# Altium schematic sheet GIC_G1.SchDoc
size A4
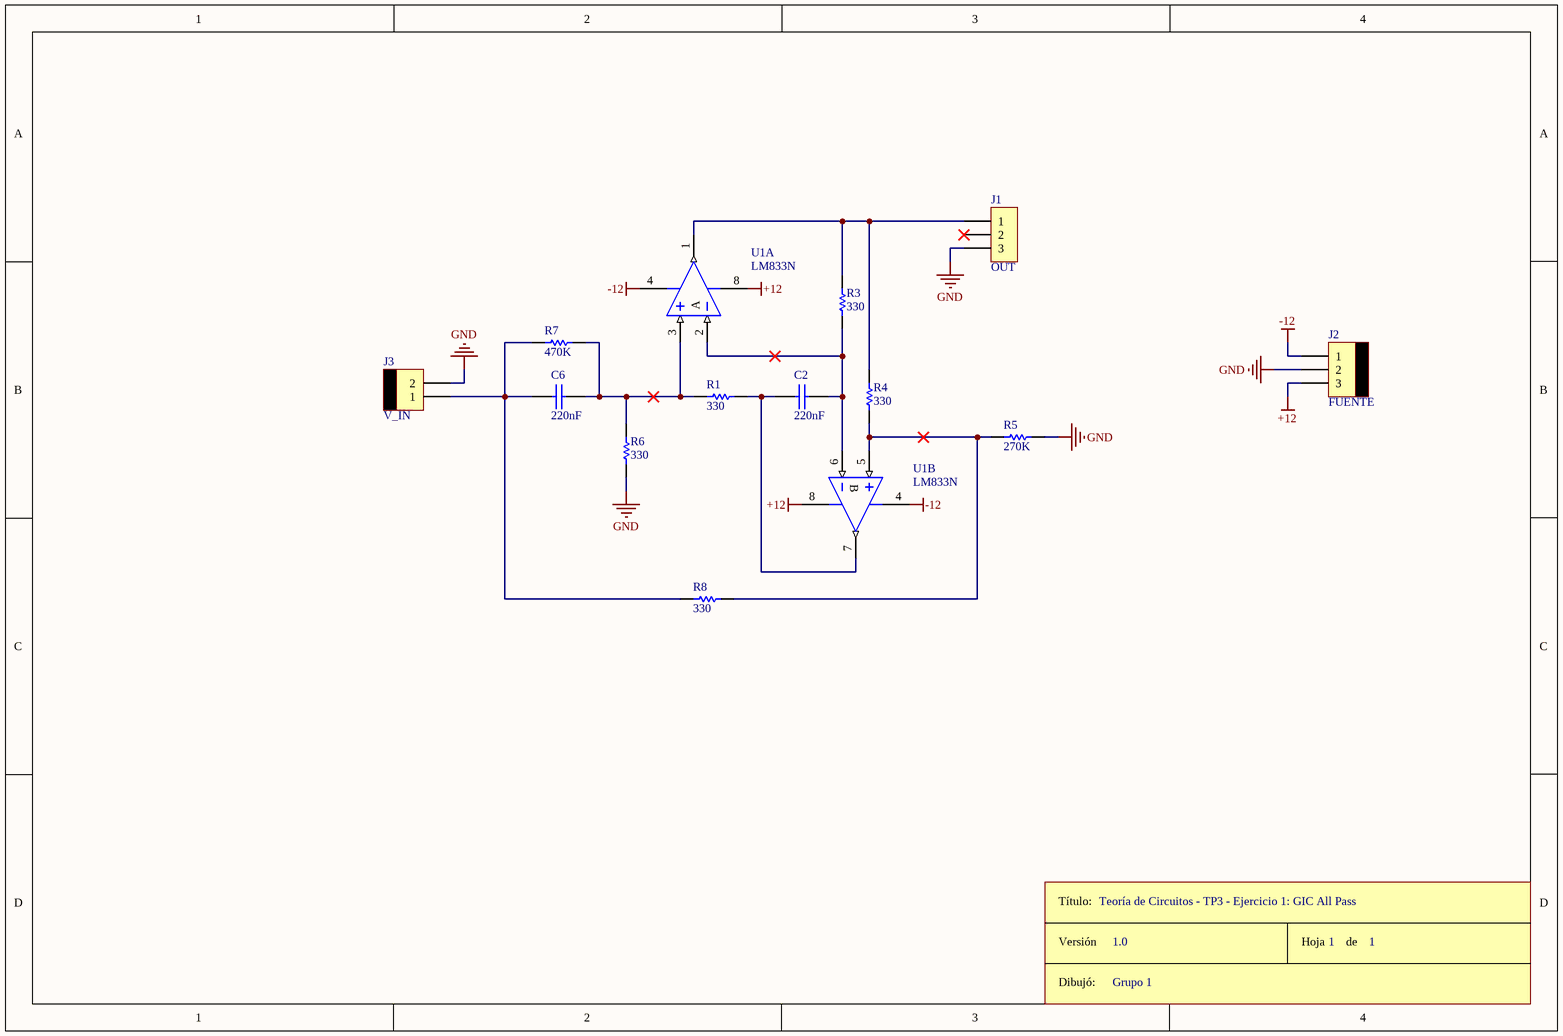
[diagram p0: GIC_G1.SchDoc]

## Parts
*  Rótulo  (value not drawn)
C2  220nF  [CAP200]
C6  220nF  [CAP200]
J1  OUT  [SIP3]
J2  FUENTE  [MOLEX3]
J3  V_IN  [MOLEX2]
R1  330  [RES400]
R3  330  [RES400]
R4  330  [RES400]
R5  270K  [RES300]
R6  330  [RES400]
R7  470K  [RES300]
R8  330  [RES400]
U1  LM833N  [DIP8]  (parts A,B of 2)

## Nets
+12: J2.3 U1.8(V+)
-12: J2.1 U1.4(V-)
GND: J1.3 J2.2 J3.2 R5.2 R6.1
NetC2_1: C2.1 R1.2 U1.7(OUT)
NetC2_2: C2.2 R3.1 U1.2(IN-) U1.6(IN-)
NetC6_1: C6.1 J3.1 R7.1 R8.1
NetC6_2: C6.2 R1.1 R6.2 R7.2 U1.3(IN+)
NetJ1_1: J1.1 R3.2 R4.2 U1.1(OUT)
NetR4_1: R4.1 R5.1 R8.2 U1.5(IN+)

Not connected (* = marked no-connect by the designer): J1 2*

## Notes on the sheet
- Teoría de Circuitos - TP3 - Ejercicio 1: GIC All Pass
- 1.0
- Grupo 1
- 1
- (in symbol LM833N, part A) A
- (in symbol LM833N, part B) B
- (in symbol Rótulo) Título:; Versión; Hoja       de; Dibujó:

## Library data of the parts
C2 C6 = CAP
J1 = CON3
J2 = MOLEX3
J3 = MOLEX2
R1 R3-R8 = RES
U1 = LM833N: Low-Noise Dual Operational Amplifier; Published: 24-Aug-2001; LatestRevisionDate: 06-Jun-2005; LatestRevisionNote: Stylized 3D Model Added.; DatasheetVersion: Dec-1997; PackageReference: DIP8; Publisher: Altium Limited; PackageDescription: DIP; 8 Leads; Row Spacing 7.62 mm; Pitch 2.54 mm; Code_JEDEC: MO-001-AN; ComponentLink1Description: Manufacturer Link; ComponentLink1URL: http://www.st.com/; ComponentLink2Description: Datasheet; ComponentLink2URL: http://www.st.com/stonline/products/literature/ds/2169/lm833.pdf